# Altium schematic sheet УШЯИ.411618.029Э Э3 Лист 6.schdoc (part 1 of 2)
size 594 x 420 mm; SheetNumber: 6; SheetTotal: 8
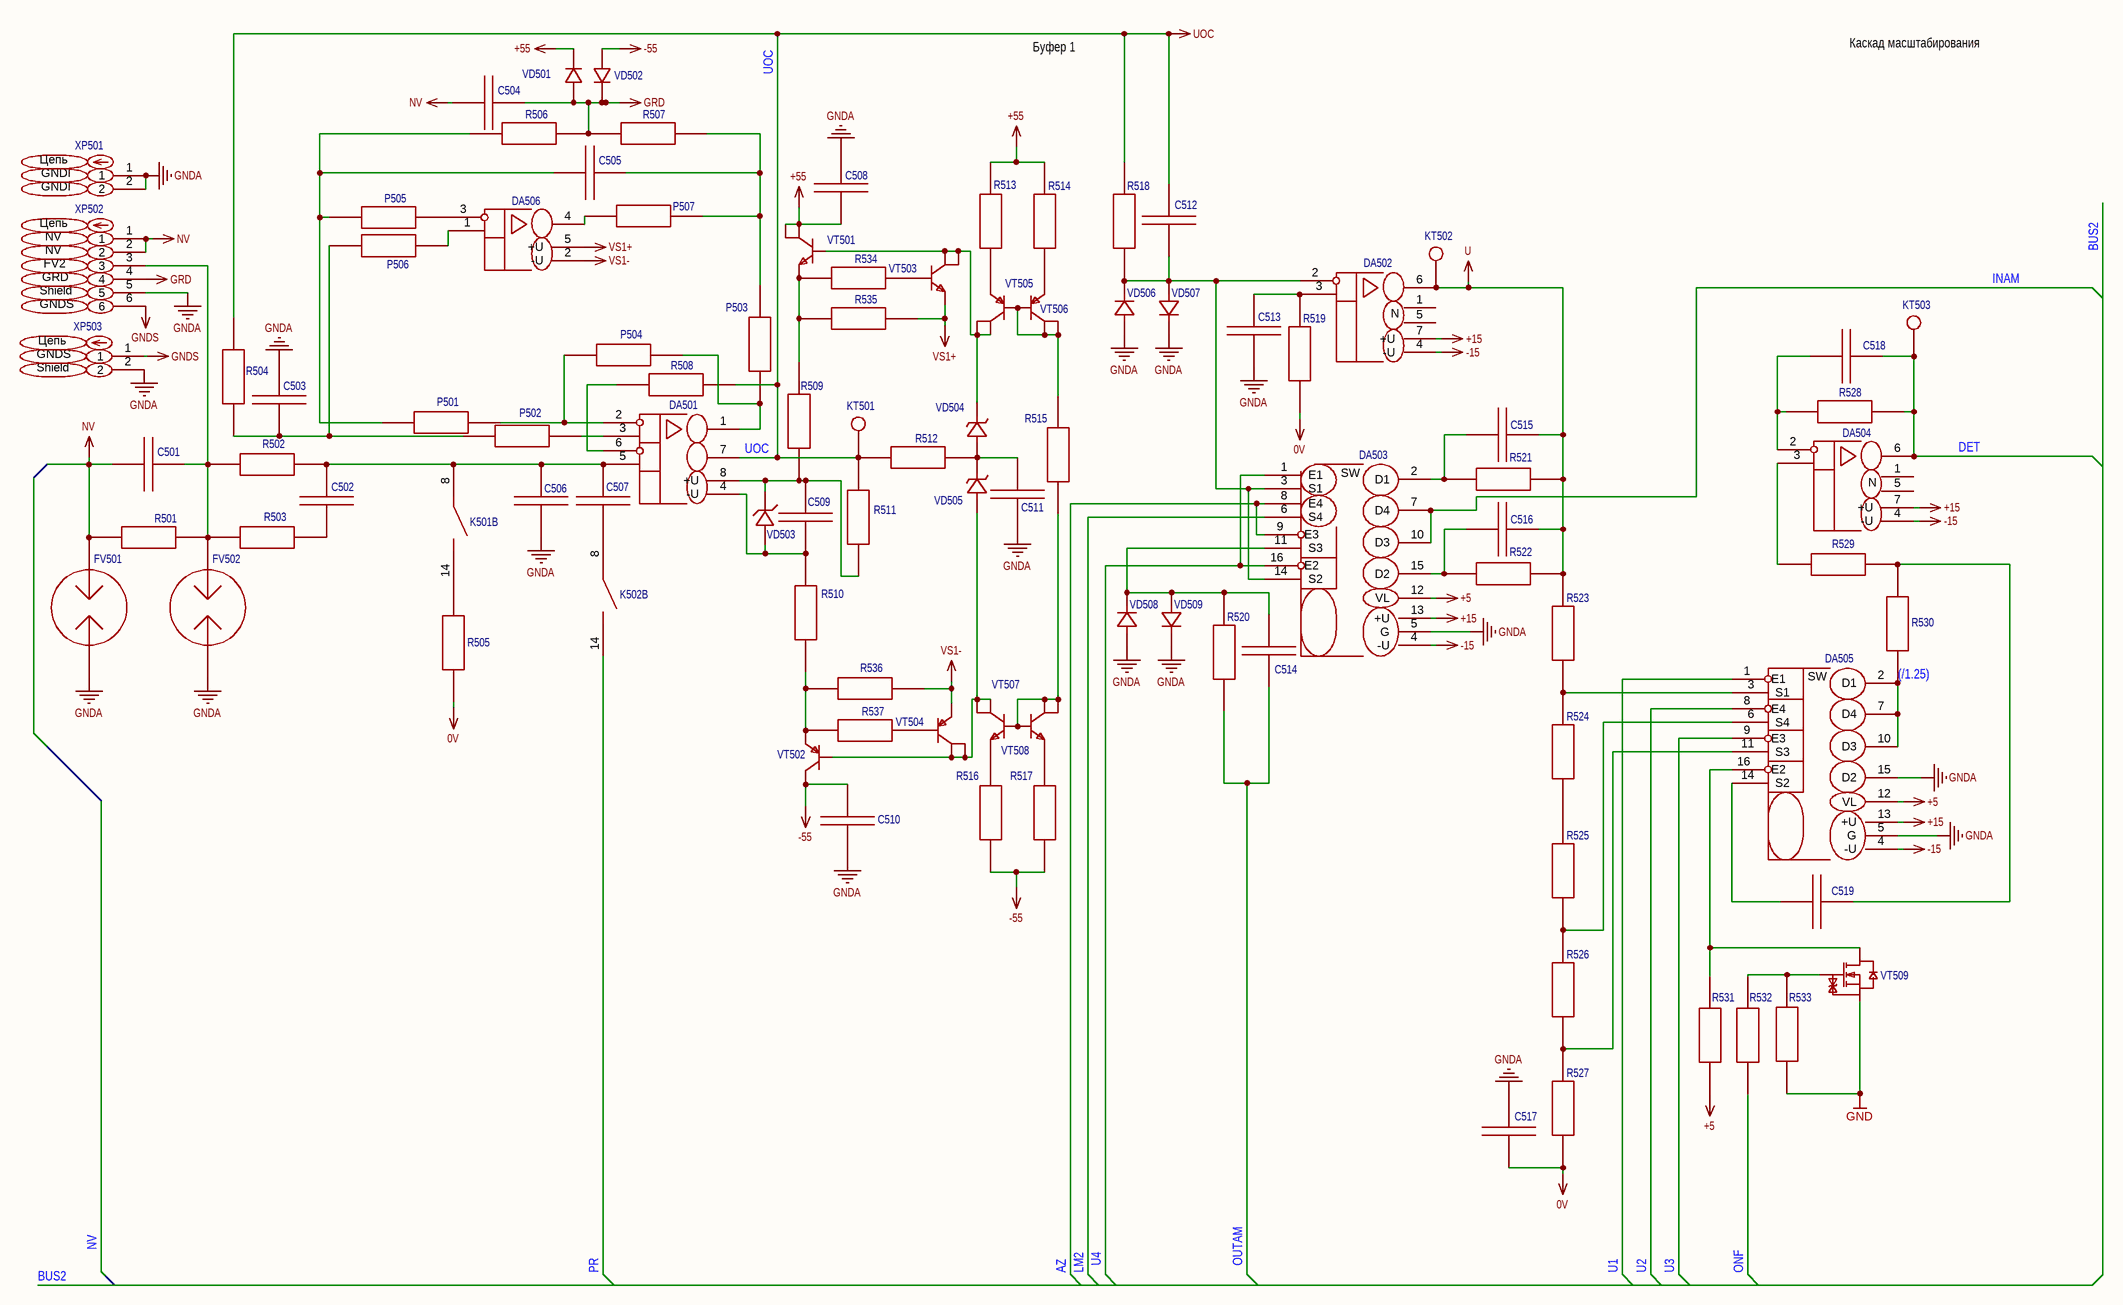
[diagram p0: УШЯИ.411618.029Э Э3 Лист 6.schdoc]

## Parts
C501  Конденсатор К10-17Б М47 47пФ  NP0 5% [DIP]  [Конденсатор К10-17Б М47 X.X.xФ  NP0 5% [DIP 8мм]]  (value not drawn)
C502  Конденсатор К10-17Б М47 47пФ  NP0 5% [DIP]  [Конденсатор К10-17Б М47 X.X.xФ  NP0 5% [DIP 8мм]]  (value not drawn)
C503  Конденсатор SMD 10пФ 100В X7R 10% [0805]  [C0805]  (value not drawn)
C504  Конденсатор К10-17Б М47 0,022мкФ  NP0 5% [DIP]  [Конденсатор К10-17Б М47 X.X.xФ  NP0 5% [DIP 5мм]]  (value not drawn)
C505  Конденсатор SMD 10пФ 100В X7R 10% [0805]  [C0805]  (value not drawn)
C506  Конденсатор К10-17Б М47 33пФ  NP0 5% [DIP]  [Конденсатор К10-17Б М47 X.X.xФ  NP0 5% [DIP 5мм]]  (value not drawn)
C507  Конденсатор К10-17Б М47 47пФ  NP0 5% [DIP]  [Конденсатор К10-17Б М47 X.X.xФ  NP0 5% [DIP 5мм]]  (value not drawn)
C508  Конденсатор SMD 0,068мкФ 100В X7R 10% [0805]  [C0805]  (value not drawn)
C509  Конденсатор SMD 5600пФ 100В X7R 10% [0805]  [C0805]  (value not drawn)
C510  Конденсатор SMD 0,068мкФ 100В X7R 10% [0805]  [C0805]  (value not drawn)
C511  Конденсатор SMD 100пФ 100В X7R 10% [0805]  [C0805]  (value not drawn)
C512  Конденсатор SMD 10пФ 100В X7R 10% [0805]  [C0805]  (value not drawn)
C513  Конденсатор SMD 51пФ 100В X7R 10% [0805]  [C0805]  (value not drawn)
C514  Конденсатор SMD 1500пФ 100В X7R 10% [0805]  [C0805]  (value not drawn)
C515  Конденсатор SMD 100пФ 100В X7R 10% [0805]  [C0805]  (value not drawn)
C516  Конденсатор SMD 10пФ 100В X7R 10% [0805]  [C0805]  (value not drawn)
C517  Конденсатор SMD 240пФ 100В X7R 10% [0805]  [C0805]  (value not drawn)
C518  Конденсатор SMD 33пФ 100В X7R 10% [0805]  [C0805]  (value not drawn)
C519  Конденсатор SMD 1500пФ 100В X7R 10% [0805]  [C0805]  (value not drawn)
DA501  Операционный усилитель TLV9152IDR [SOIC-8]  [SOIC-8_L4.9-W3.9-P1.27-LS6.0-BL]  (value not drawn)
DA502  Операционный усилитель ADA4627-1BRZ [SOIC-8]  [SOIC-8_L5.0-W4.0-P1.27-LS6.1-BL]  (value not drawn)
DA503  Коммутатор аналоговых сигналов ADG433BRZ [SOIC-16]  [SOIC-16_L9.9-W3.9-P1.27-LS6.0-BL]  (value not drawn)
DA504  Операционный усилитель ADA4627-1BRZ [SOIC-8]  [SOIC-8_L5.0-W4.0-P1.27-LS6.1-BL]  (value not drawn)
DA505  Коммутатор аналоговых сигналов ADG431BRZ [SOIC-16]  [SOIC-16_L9.9-W3.9-P1.27-LS6.0-BL]  (value not drawn)
DA506  Операционный усилитель  TLV9151IDCKR [SC-70-5]  [SC-70-5_L2.1-W1.3-P0.65-LS2.2-BR]  (value not drawn)
FV501  Разрядник газонаполненный B88069-X8870-B502 (A81-C90X)  (value not drawn)
FV502  Разрядник газонаполненный B88069-X8870-B502 (A81-C90X)  (value not drawn)
K501  Реле герконовое DIP05-1A72-13L  [PCB]  [RELAY-TH_STANDEXMEDER_DIP05-1A72-13L]  (value not drawn)  (part B of 2)
K502  Реле герконовое DIP05-1A72-13L  [PCB]  [RELAY-TH_STANDEXMEDER_DIP05-1A72-13L]  (value not drawn)  (part B of 2)
KT501  Control point  (value not drawn)
KT502  Control point  (value not drawn)
KT503  Control point  (value not drawn)
P501  Перемычка  [R0805]  (value not drawn)
P502  Перемычка  [R0805]  (value not drawn)
P503  Перемычка  [R0805]  (value not drawn)
P504  Перемычка  [R0805]  (value not drawn)
P505  Перемычка  [R0805]  (value not drawn)
P506  Перемычка  [R0805]  (value not drawn)
P507  Перемычка  [R0805]  (value not drawn)
R501  Резистор C2-29В-0,25 1,2кОм ±0,5% [DIP]  (value not drawn)
R502  Резистор C2-29В-0,25 301кОм ±0,5% [DIP]  (value not drawn)
R503  Резистор C2-29В-0,25 5.1кОм ±0,5% [DIP]  (value not drawn)
R504  Резистор 91кОм 0,125Вт 1% [0805]  [R0805]  (value not drawn)
R505  Резистор 2.4кОм 0,25Вт 1% [1206]  [R1206]  (value not drawn)
R506  Резистор C2-29В-0,25 51Ом ±0,5% [DIP]  (value not drawn)
R507  Резистор C2-29В-0,25 22Ом ±0,5% [DIP]  (value not drawn)
R508  Резистор 33Ом 0,125Вт 1% [0805]  [R0805]  (value not drawn)
R509  Резистор 150Ом 0,125Вт 1% [0805]  [R0805]  (value not drawn)
R510  Резистор 150Ом 0,125Вт 1% [0805]  [R0805]  (value not drawn)
R511  Резистор 5,1кОм 0,125Вт 1% [0805]  [R0805]  (value not drawn)
R512  Резистор 4,7кОм 0,125Вт 1% [0805]  [R0805]  (value not drawn)
R513  Резистор 820Ом 0,125Вт 1% [0805]  [R0805]  (value not drawn)
R514  Резистор 2кОм 0,125Вт 1% [0805]  [R0805]  (value not drawn)
R515  Резистор 200кОм 0,125Вт 1% [0805]  [R0805]  (value not drawn)
R516  Резистор 820Ом 0,125Вт 1% [0805]  [R0805]  (value not drawn)
R517  Резистор 2кОм 0,125Вт 1% [0805]  [R0805]  (value not drawn)
R518  Резистор 40,2кОм 0.25Вт 1% [1206]  [R0805]  (value not drawn)
R519  Резистор 15кОм 0,125Вт 1% [0805]  [R0805]  (value not drawn)
R520  Резистор 200кОм 0,125Вт 1% [0805]  [R0805]  (value not drawn)
R521  Резистор 10кОм 0,125Вт 1% [0805]  [R0805]  (value not drawn)
R522  Резистор 100кОм 0,125Вт 1% [0805]  [R0805]  (value not drawn)
R523  Резистор 4,02кОм 0.25Вт 1% [1206]  [R1206]  (value not drawn)
R524  Резистор 4,02кОм 0.25Вт 1% [1206]  [R1206]  (value not drawn)
R525  Резистор 4,02кОм 0.25Вт 1% [1206]  [R1206]  (value not drawn)
R526  Резистор 4,02кОм 0.25Вт 1% [1206]  [R1206]  (value not drawn)
R527  Резистор 4,02кОм 0.25Вт 1% [1206]  [R1206]  (value not drawn)
R528  Резистор 3,6кОм 0,125Вт 1% [0805]  [R0805]  (value not drawn)
R529  Резистор 110кОм 0,125Вт 1% [0805]  [R0805]  (value not drawn)
R530  Резистор 110кОм 0,125Вт 1% [0805]  [R0805]  (value not drawn)
R531  Резистор 5,3кОм 0,125Вт 1% [0805]  [R0805]  (value not drawn)
R532  Резистор 100Ом 0,125Вт 1% [0805]  [R0805]  (value not drawn)
R533  Резистор 100Ом 0,125Вт 1% [0805]  [R0805]  (value not drawn)
R534  Резистор 400Ом 0,125Вт 1% [0805]  [R0805]  (value not drawn)
R535  Резистор 150Ом 0,125Вт 1% [0805]  [R0805]  (value not drawn)
R536  Резистор 150Ом 0,125Вт 1% [0805]  [R0805]  (value not drawn)
R537  Резистор 400Ом 0,125Вт 1% [0805]  [R0805]  (value not drawn)
VD501  Диод импульсный 1N4448 [DO-35]  [DO-35_BD2.0-L4.2-P8.20-D0.5-RD]  (value not drawn)
VD502  Диод импульсный 1N4448 [DO-35]  [DO-35_BD2.0-L4.2-P8.20-D0.5-RD]  (value not drawn)
VD503  Стабилитрон MMSZ5230B 4.7В 0.5Вт [SOD123]  [SOD-123_L2.8-W1.8-LS3.7-RD]  (value not drawn)
VD504  Стабилитрон MMSZ5232B 5.6В 0.5Вт [SOD123]  [SOD-123_L2.7-W1.6-LS3.7-RD]  (value not drawn)
VD505  Стабилитрон MMSZ5232B 5.6В 0.5Вт [SOD123]  [SOD-123_L2.7-W1.6-LS3.7-RD]  (value not drawn)
VD506  Диод импульсный 1N4448 [SOD-123]  [SOD-123_L2.7-W1.6-LS3.7-RD-1]  (value not drawn)
VD507  Диод импульсный 1N4448 [SOD-123]  [SOD-123_L2.7-W1.6-LS3.7-RD-1]  (value not drawn)
VD508  Диод импульсный 1N4448 [SOD-123]  [SOD-123_L2.7-W1.6-LS3.7-RD-1]  (value not drawn)
VD509  Диод импульсный 1N4448 [SOD-123]  [SOD-123_L2.7-W1.6-LS3.7-RD-1]  (value not drawn)
VT501  Транзистор DZT658 NPN [SOT223]  [SOT-223-3_L6.5-W3.4-P2.30-LS7.0-BR]  (value not drawn)
VT502  Транзистор FZT758 PNP [SOT223]  [SOT-223_L6.5-W3.5-P2.30-LS7.0-BR]  (value not drawn)
VT503  Транзистор DZTA42 NPN [SOT223]  [SOT-223-4_L6.5-W3.5-P2.30-LS7.0-BR]  (value not drawn)
VT504  Транзистор DZTA92 PNP [SOT223]  [SOT-223-3_L6.5-W3.4-P2.30-LS7.0-BR]  (value not drawn)
VT505  Транзистор DZTA92 PNP [SOT223]  [SOT-223-3_L6.5-W3.4-P2.30-LS7.0-BR]  (value not drawn)
VT506  Транзистор DZTA92 PNP [SOT223]  [SOT-223-3_L6.5-W3.4-P2.30-LS7.0-BR]  (value not drawn)
VT507  Транзистор DZTA42 NPN [SOT223]  [SOT-223-4_L6.5-W3.5-P2.30-LS7.0-BR]  (value not drawn)
VT508  Транзистор DZTA42 NPN [SOT223]  [SOT-223-4_L6.5-W3.5-P2.30-LS7.0-BR]  (value not drawn)
VT509  Транзистор полевой MOSFET N-канальный BSS138BK [SOT-23-3]  [SOT-23-3_L2.9-W1.3-P1.90-LS2.4-BR]  (value not drawn)
XP501  Вилка на плату 280370-2 шаг 2.54мм  [CONN-TH_280370-2]  (value not drawn)
XP502  Вилка на плату 280372-1 шаг 2.54мм  [CONN-TH_280372-1]  (value not drawn)
XP503  Вилка на плату 280370-2 шаг 2.54мм  [CONN-TH_280370-2]  (value not drawn)

## Nets
0V: C517.2 R505.1 R519.1 R527.1
+5: DA503.12(VL) DA505.12(VL) R531.1
+15: DA502.7(+U) DA503.13(+U) DA504.7(+U) DA505.13(+U)
+55: C508.1 R513.2 R514.2 VD501.1 VT501.2(C) VT501.4(C)
-15: DA502.4(-U) DA503.4(-U) DA504.4(-U) DA505.4(-U)
-55: C510.1 R516.1 R517.1 VD502.2 VT502.2(C) VT502.4(C)
GND: R533.1 VT509.2(S)
GNDA: C503.2 C506.2 C508.2 C510.2 C511.1 C513.2 C517.1 DA503.5(G) DA505.5(G) DA505.15(D2) FV501.2 FV502.2 VD506.2(A) VD507.1(C) VD508.2(A) VD509.1(C) XP501.1 XP501.2 XP502.5 XP503.2
GNDS: XP502.6 XP503.1
GRD: C504.2 R506.2 R507.1 VD501.2 VD502.1 XP502.4
NV: C501.2 C504.1 FV501.1 R501.1 XP502.1 XP502.2
U: C515.1 C516.1 DA502.6(OUT) KT502.1 R521.2 R522.2 R523.2
UOC: C512.2 DA501.7(OUT) KT501.1 R504.2 R508.2 R511.1 R512.1 R518.1
VS1+: DA506.5(+U) R535.1 VT503.3(E)
VS1-: DA506.2(-U) R536.1 VT504.3(E)
(/1.25): DA505.2(D1) DA505.7(D4) DA505.10(D3) R530.1
AZ: DA503.8(E4) DA503.9(E3)
DET: C518.2 DA504.6(OUT) KT503.1 R528.1
INAM: DA503.7(D4) DA503.10(D3)
LM2: DA503.6(S4)
ONF: R532.1
OUTAM: C514.1 R520.2
PR: K502.14
U1: DA505.1(E1)
U2: DA505.8(E4)
U3: DA505.9(E3)
U4: DA503.1(E1) DA503.16(E2)
NetC501_1: C501.1 FV502.1 R501.2 R502.1 R503.1 XP502.3
NetC502_1: C502.1 C506.1 C507.2 DA501.5(+IN) K501.8 R502.2
NetC502_2: C502.2 R503.2
NetC503_1: C503.1 P502.2 P506.2 R504.1
NetC505_1: C505.1 P501.2 P505.2 R506.1
NetC505_2: C505.2 P503.2 P507.1 R507.2
NetC507_1: C507.1 K502.8
NetC509_1: C509.1 DA501.4(-U) R510.2 VD503.2(A)
NetC509_2: C509.2 DA501.8(+U) R509.1 R511.2 VD503.1(K)
NetC511_2: C511.2 R512.2 VD504.2(A) VD505.1(K)
NetC512_1: C512.1 DA502.2(-IN) DA503.3(S1) DA503.14(S2) R518.2 VD506.1(C) VD507.2(A)
NetC513_1: C513.1 DA502.3(+IN) R519.2
NetC514_2: C514.2 DA503.11(S3) R520.1 VD508.1(C) VD509.2(A)
NetC515_2: C515.2 DA503.2(D1) R521.1
NetC516_2: C516.2 DA503.15(D2) R522.1
NetC518_1: C518.1 DA504.2(-IN) R528.2
NetC519_1: C519.1 DA505.14(S2)
NetC519_2: C519.2 R529.1 R530.2
NetDA501_1: DA501.1(OUT) P503.1 P504.1
NetDA501_2: DA501.2(-IN) P501.1 P504.2
NetDA501_3: DA501.3(+IN) P502.1
NetDA501_6: DA501.6(-IN) R508.1
NetDA504_3: DA504.3(+IN) R529.2
NetDA505_3: DA505.3(S1) R523.1 R524.2
NetDA505_6: DA505.6(S4) R525.1 R526.2
NetDA505_11: DA505.11(S3) R526.1 R527.2
NetDA505_16: DA505.16(E2) R531.2 VT509.3(D)
NetDA506_1: DA506.1(+IN) P506.1
NetDA506_3: DA506.3(-IN) P505.1
NetDA506_4: DA506.4(OUT) P507.2
NetK501_14: K501.14 R505.2
NetR509_2: R509.2 R534.2 R535.2 VT501.3(E)
NetR510_1: R510.1 R536.2 R537.2 VT502.3(E)
NetR513_1: R513.1 VT505.3(E)
NetR514_1: R514.1 VT506.3(E)
NetR515_1: R515.1 VT507.1(B) VT508.1(B) VT508.2(C) VT508.4(C)
NetR515_2: R515.2 VT505.1(B) VT506.1(B) VT506.2(C) VT506.4(C)
NetR516_2: R516.2 VT507.3(E)
NetR517_2: R517.2 VT508.3(E)
NetR524_1: R524.1 R525.2
NetR532_2: R532.2 R533.2 VT509.1(G)
NetR534_1: R534.1 VT503.1(B)
NetR537_1: R537.1 VT504.1(B)
NetVD504_1: VD504.1(K) VT501.1(B) VT503.2(C) VT503.4(C) VT505.2(C) VT505.4(C)
NetVD505_2: VD505.2(A) VT502.1(B) VT504.2(C) VT504.4(C) VT507.2(C) VT507.4(C)

Not connected (* = marked no-connect by the designer): DA502 1(N) 5(N); DA504 1(N) 5(N)

## Buses and harness runs
bus BUS2

## Notes on the sheet
- Буфер 1
- Каскад масштабирования
- GNDI
- NV
- GNDS
- (near XP502) Shield
- (near XP502) GRD
- (near XP502) FV2
- (near XP503) Shield
- Подп. и дата
- Инв.№ дубл.
- Взам.инв.№
- Подп.и дата
- Инв.№ подл.
- Изм.
- Лист
- № докум.
- Подп.
- Дата
- Формат  A2
- (in symbol Вилка на плату 280370-2 шаг 2.54мм) Цепь
- (in symbol Вилка на плату 280372-1 шаг 2.54мм) Цепь
- (in symbol Коммутатор аналоговых сигналов ADG431BRZ [SOIC-16]) SW
- (in symbol Коммутатор аналоговых сигналов ADG433BRZ [SOIC-16]) SW